# Altium schematic sheet 0060_DG2 DISPLAY - HDMI.SchDoc
size 848 x 558 mm
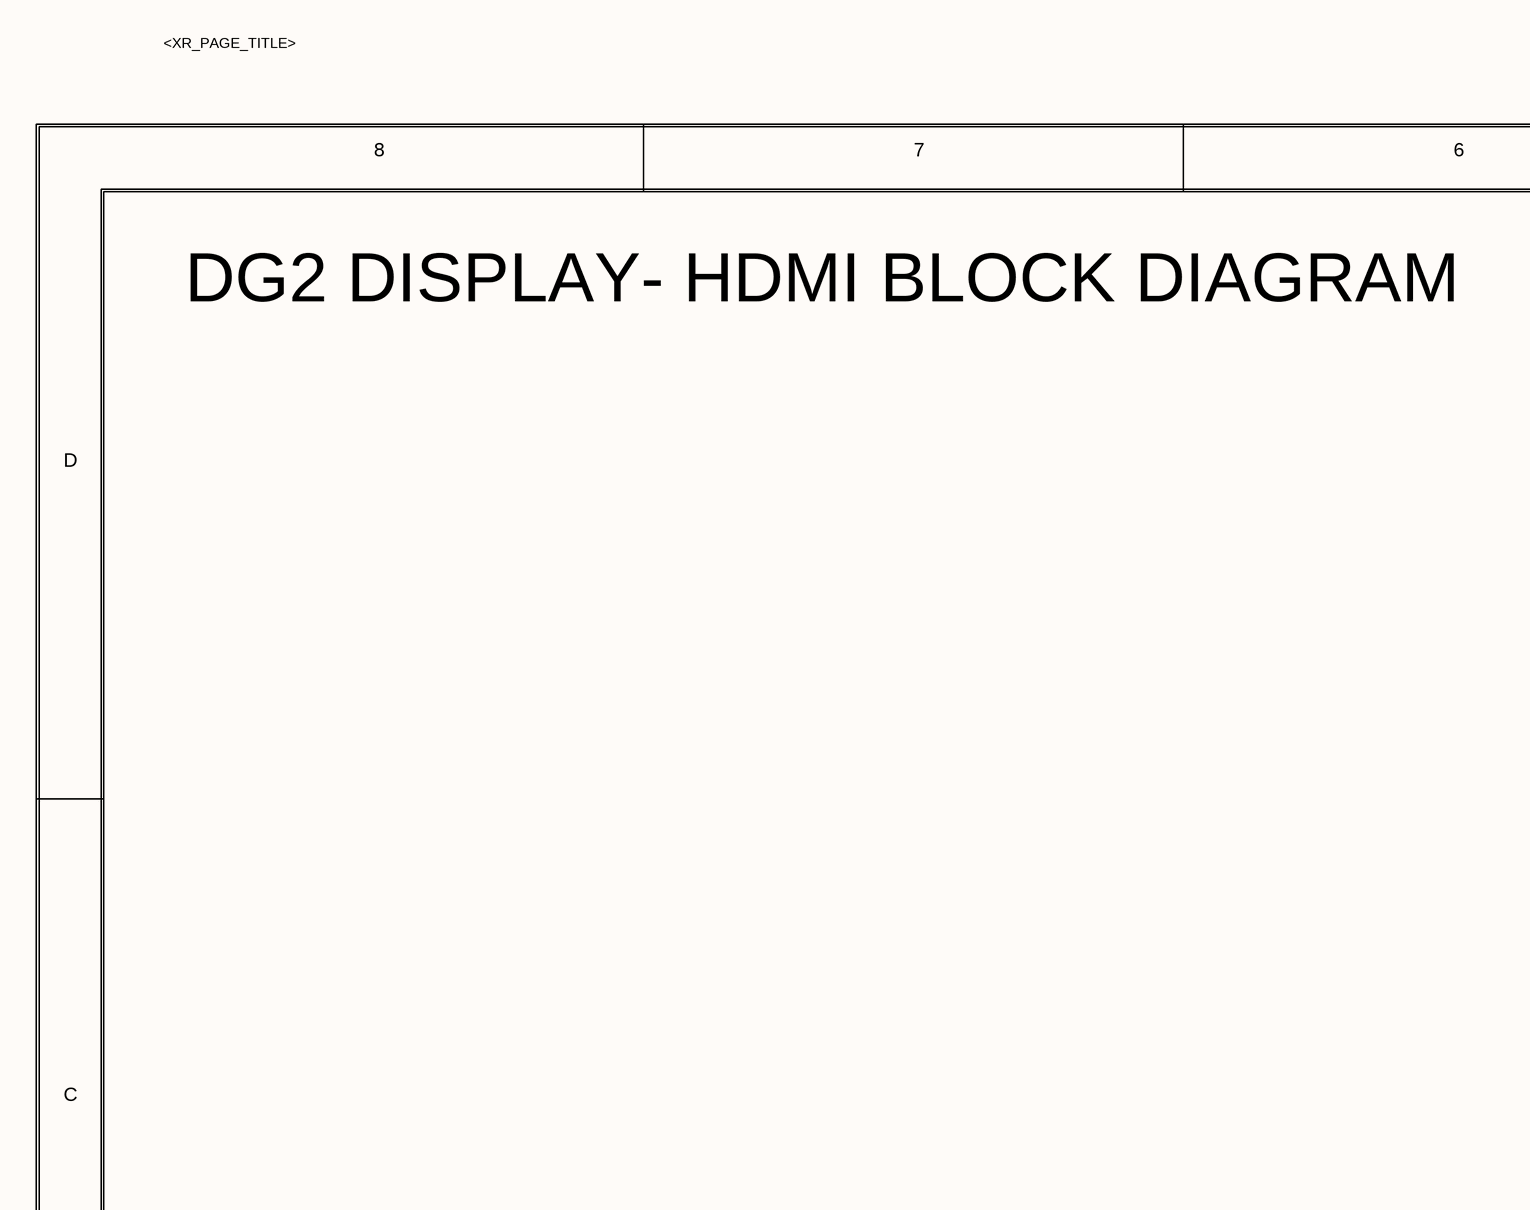
[diagram p0: 0060_DG2 DISPLAY - HDMI.SchDoc, top left]
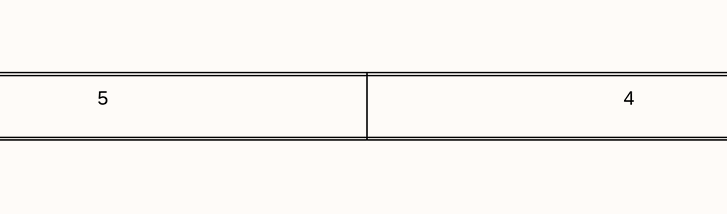
[diagram p1: 0060_DG2 DISPLAY - HDMI.SchDoc, top middle]
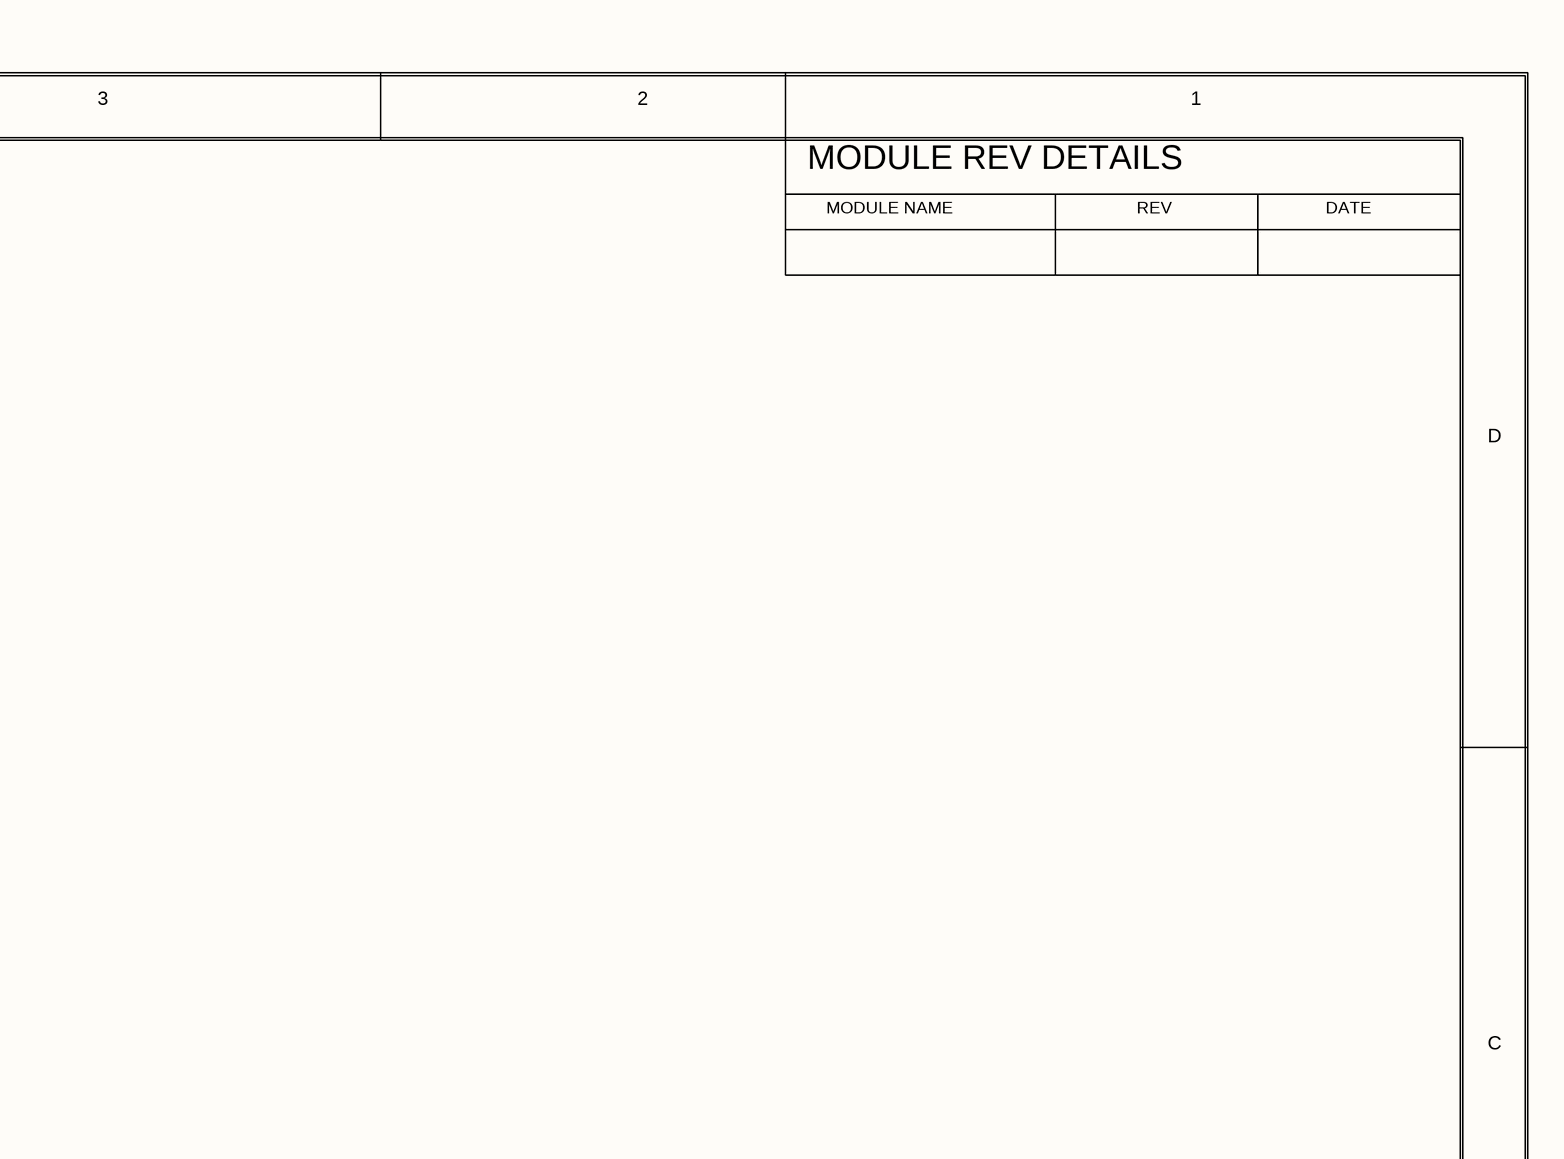
[diagram p2: 0060_DG2 DISPLAY - HDMI.SchDoc, top right]
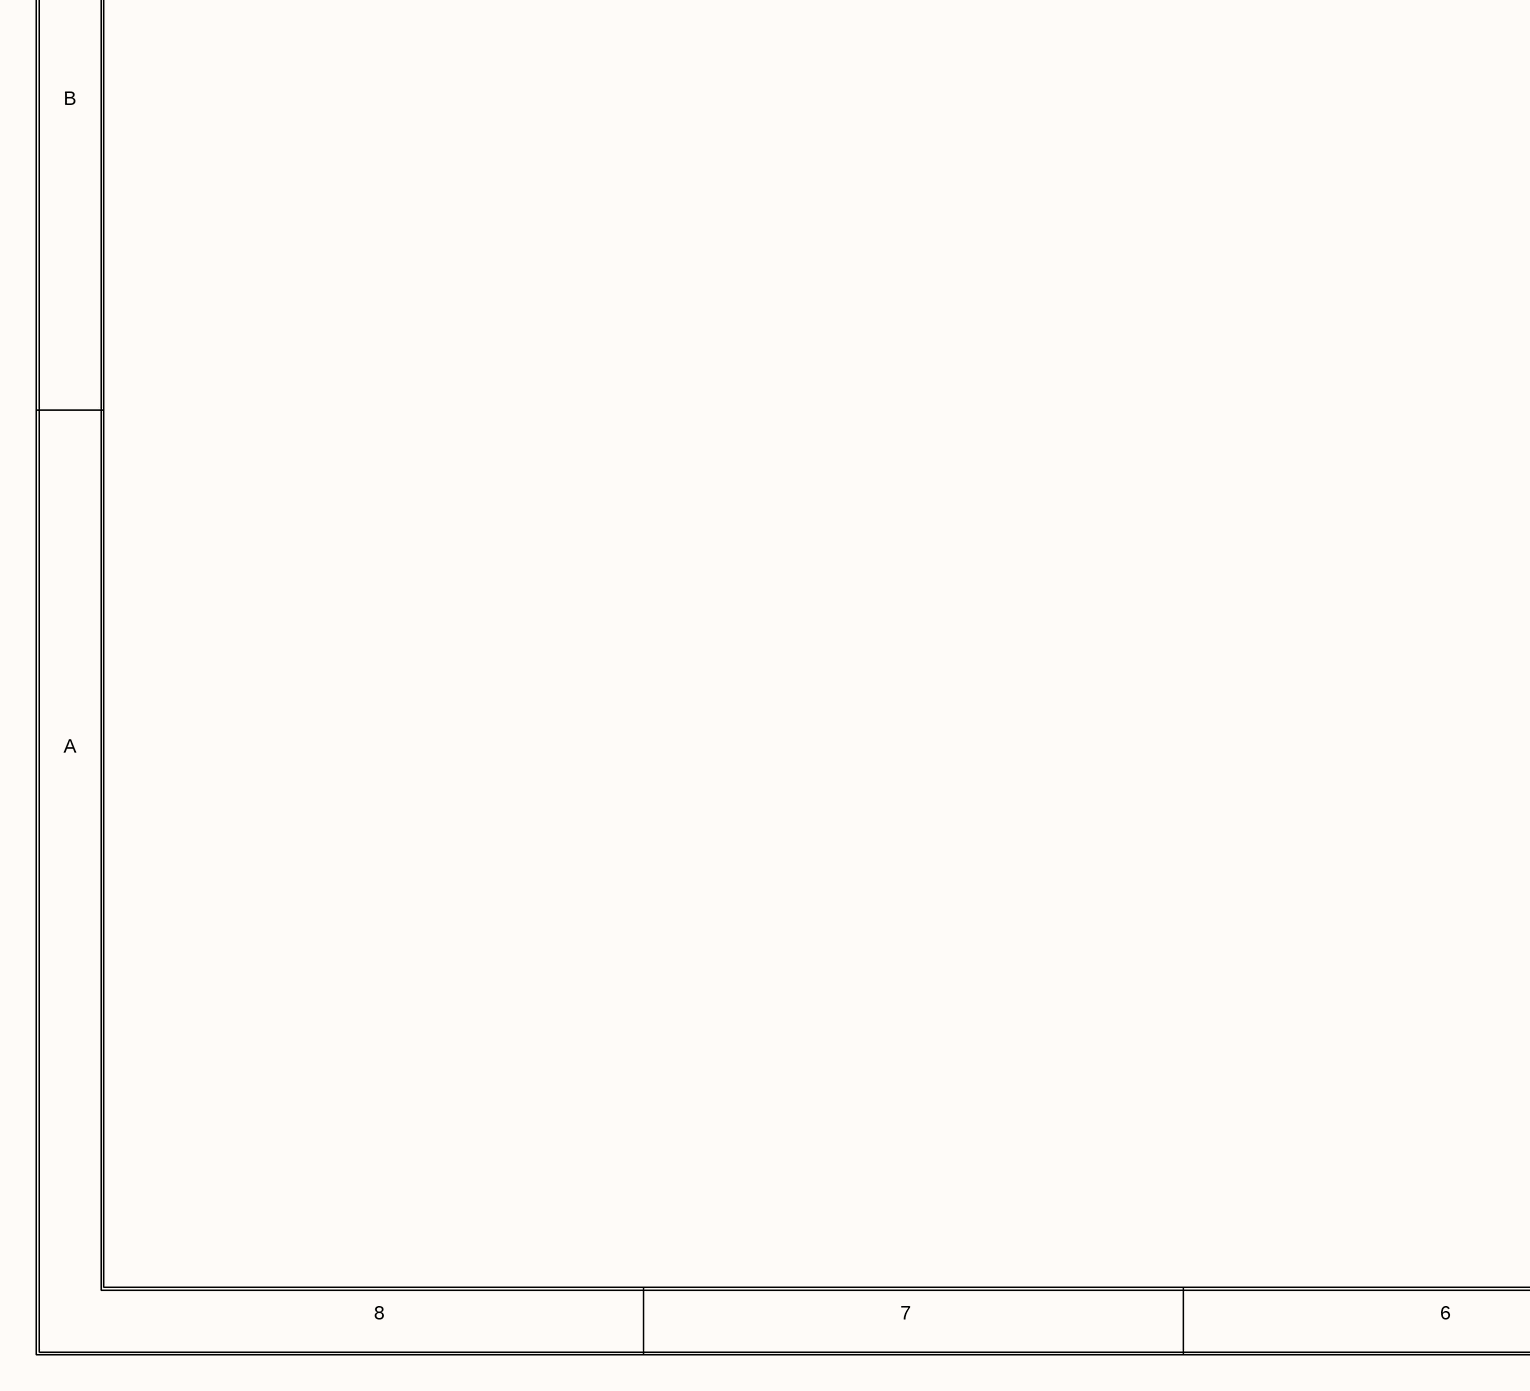
[diagram p3: 0060_DG2 DISPLAY - HDMI.SchDoc, bottom left]
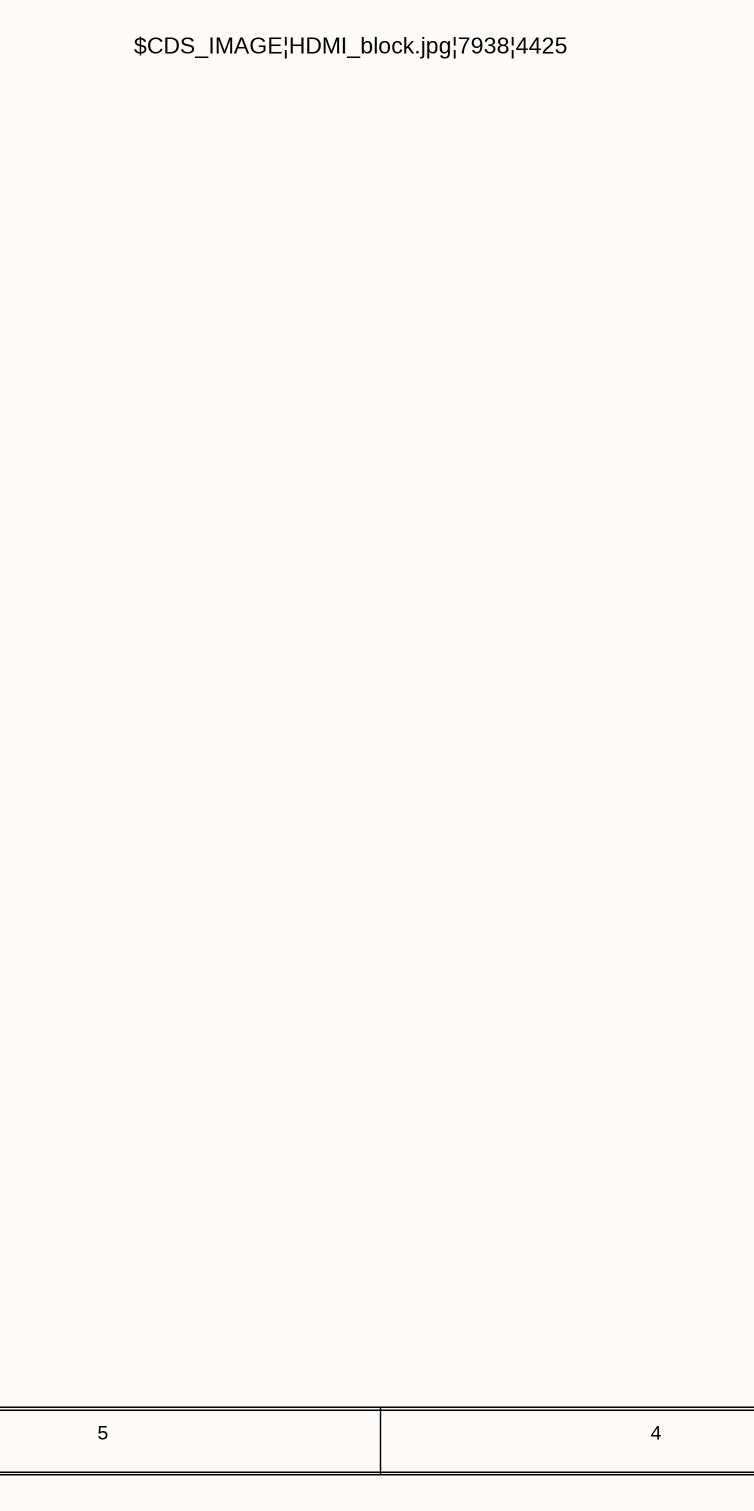
[diagram p4: 0060_DG2 DISPLAY - HDMI.SchDoc, bottom middle]
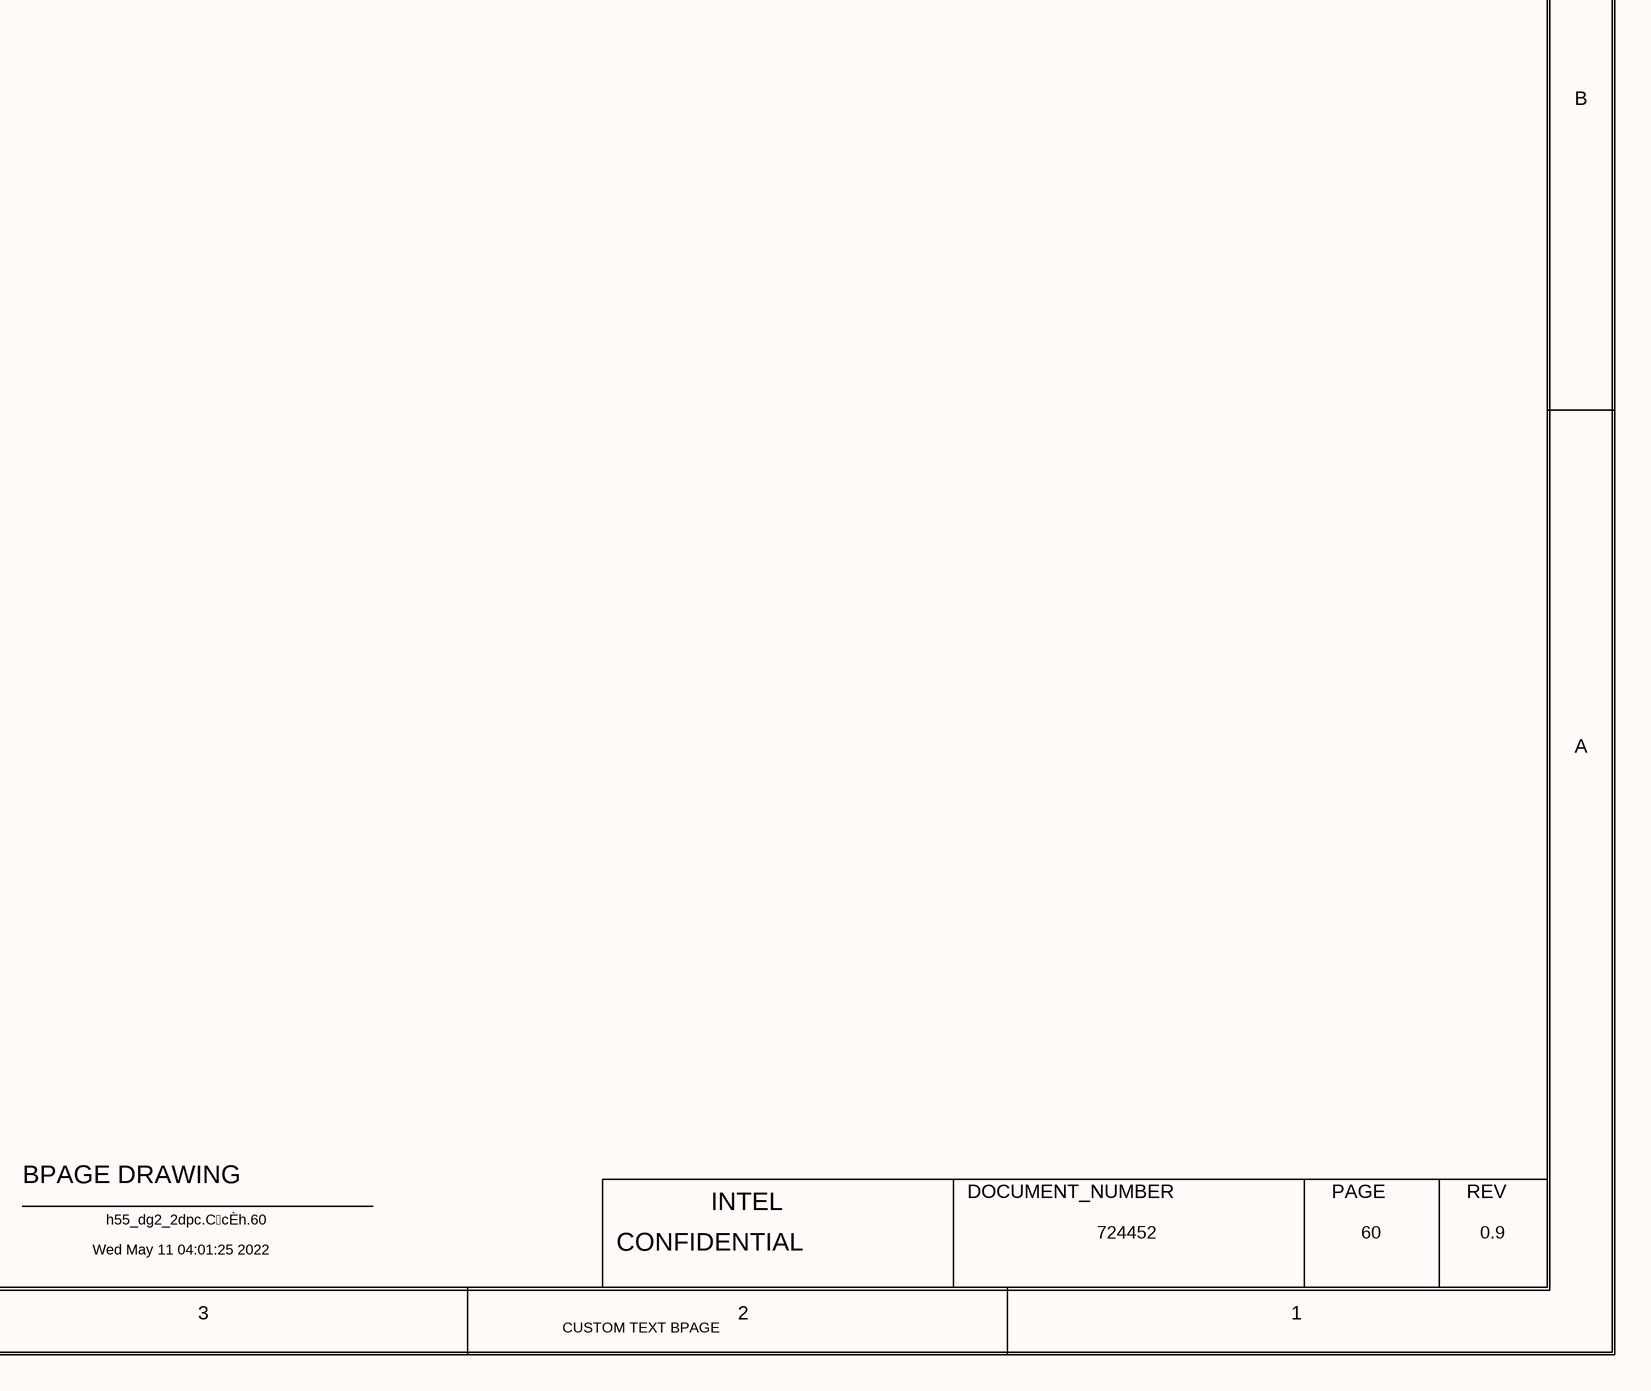
[diagram p5: 0060_DG2 DISPLAY - HDMI.SchDoc, bottom right]

## Notes on the sheet
- <XR_PAGE_TITLE>
- 8
- 7
- 6
- 5
- 4
- 3
- 2
- 1
- MODULE REV DETAILS
- DG2 DISPLAY- HDMI BLOCK DIAGRAM
- MODULE NAME
- REV
- DATE
- D
- C
- $CDS_IMAGE|HDMI_block.jpg|7938|4425
- B
- A
- BPAGE DRAWING
- INTEL
- DOCUMENT_NUMBER
- PAGE
- Wed May 11 04:01:25 2022
- h55_dg2_2dpc.CcÈh.60
- CONFIDENTIAL
- 724452
- 60
- 0.9
- CUSTOM TEXT BPAGE